# EAGLE schematic FPGA Shield Adapter (EAGLE 9.5.0)
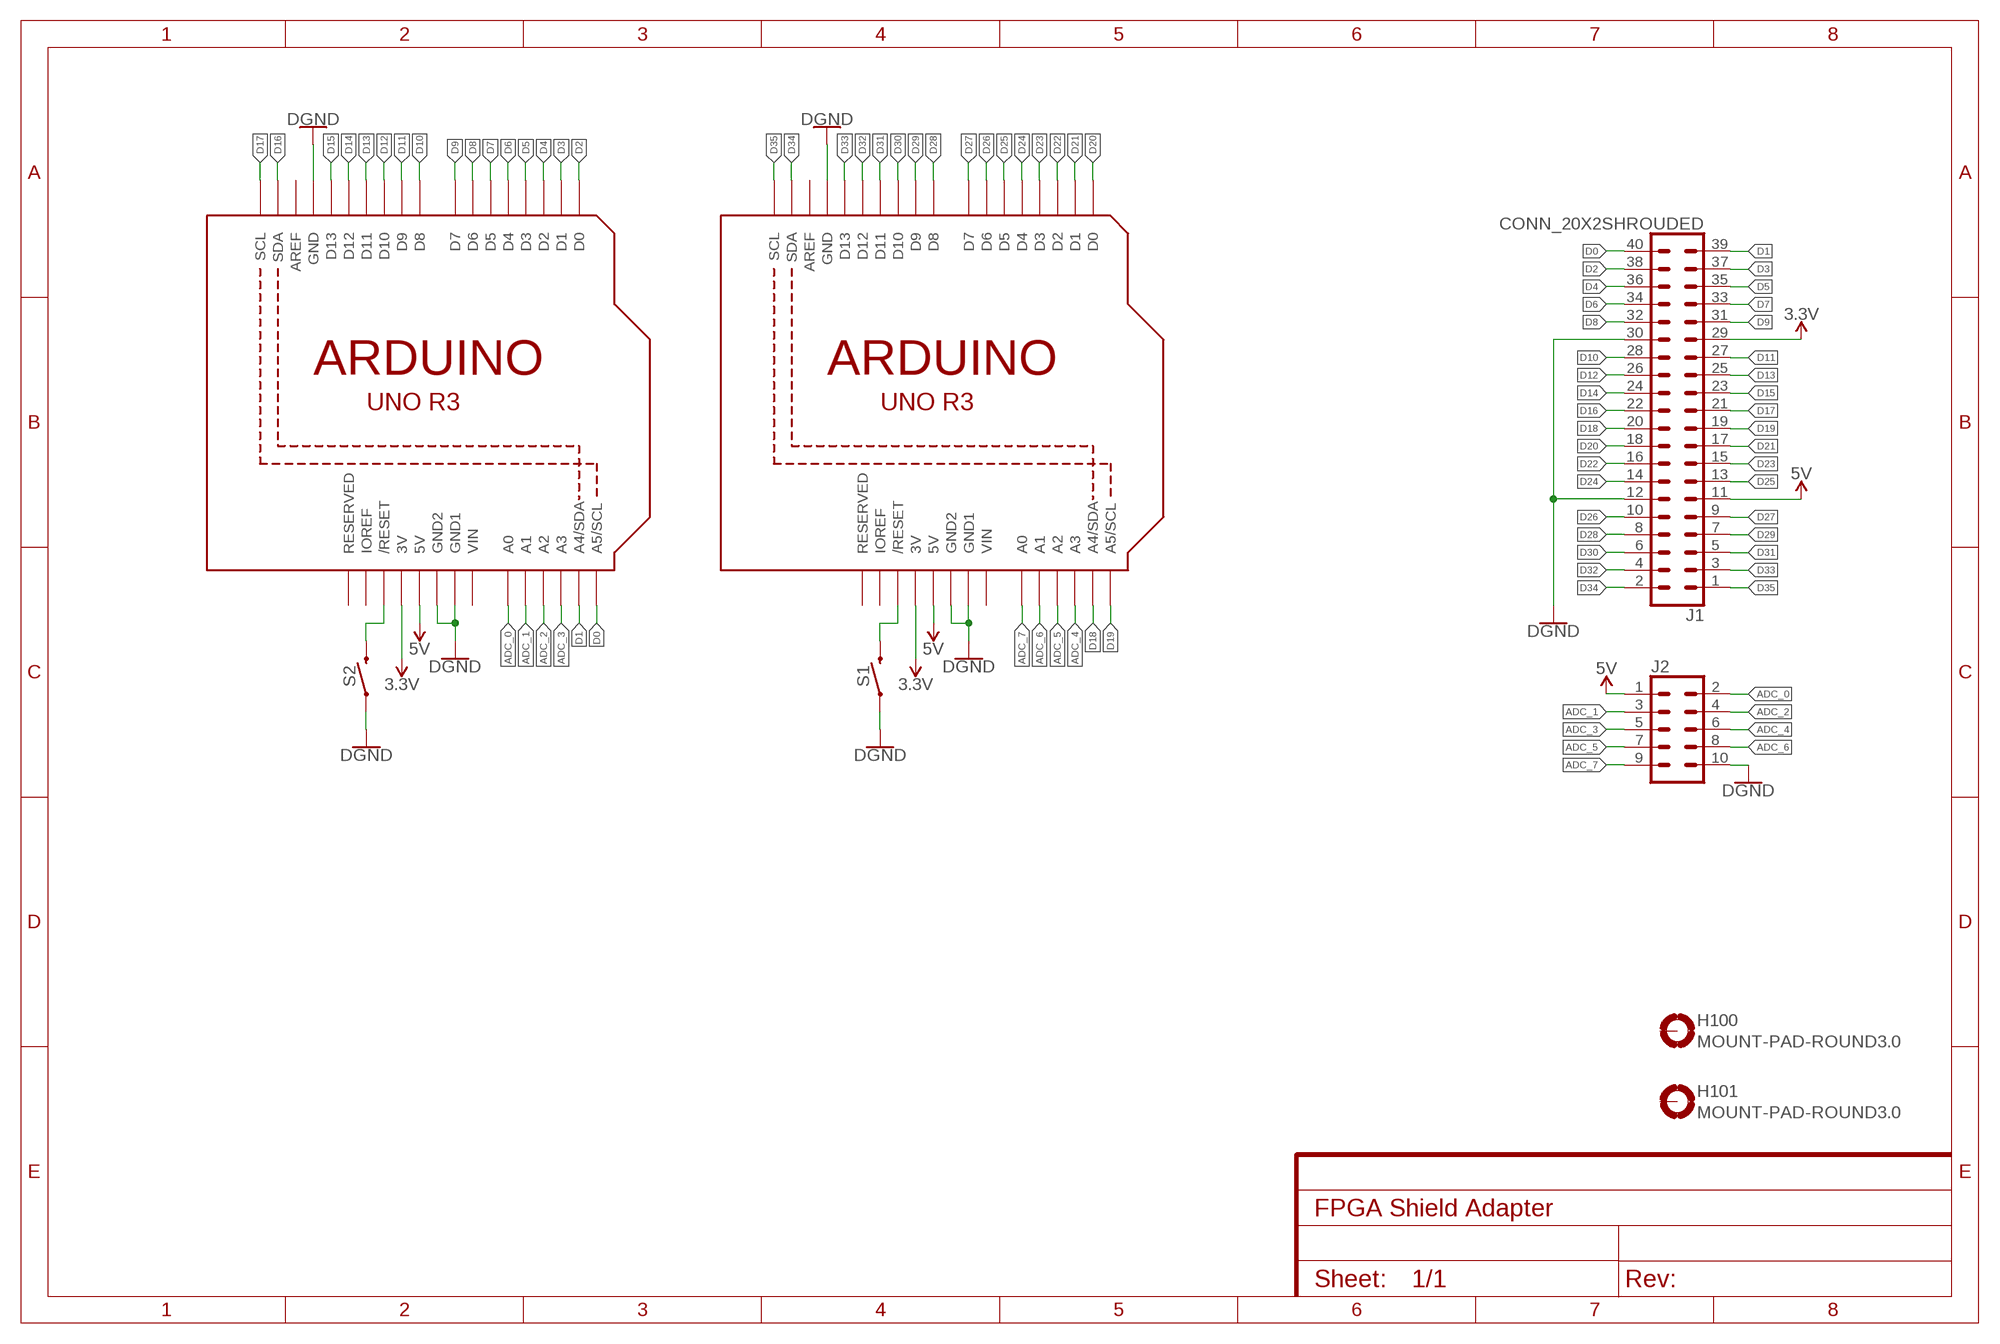
[diagram p0: schematic, sheet 1]

## Parts
H100  MOUNT-PAD-ROUND3.0  [3,0-PAD]
H101  MOUNT-PAD-ROUND3.0  [3,0-PAD]
J1  CONN_20X2SHROUDED  [2X20_SHROUDED]
J2  CONN_05X2SHD  [2X5-SHROUDED]
S1  MOMENTARY-SWITCH-SPST-SMD-5.2MM  [TACTILE_SWITCH_SMD_5.2MM]
S2  MOMENTARY-SWITCH-SPST-SMD-5.2MM  [TACTILE_SWITCH_SMD_5.2MM]
U1  ARDUINOR3NODIM  [ARDUINOR3-NODIM]
U2  ARDUINOR3NODIM  [ARDUINOR3-NODIM]

## Nets
3.3V: J1.29 U1.3V U2.3V
5V: J1.11 J2.1 U1.5V U2.5V
ADC_0: J2.2 U2.A0
ADC_1: J2.3 U2.A1
ADC_2: J2.4 U2.A2
ADC_3: J2.5 U2.A3
ADC_4: J2.6 U1.A3
ADC_5: J2.7 U1.A2
ADC_6: J2.8 U1.A1
ADC_7: J2.9 U1.A0
D0: J1.40 U2.A5(A5/SCL)
D1: J1.39 U2.A4(A4/SDA)
D2: J1.38 U2.D0
D3: J1.37 U2.D1
D4: J1.36 U2.D2
D5: J1.35 U2.D3
D6: J1.34 U2.D4
D7: J1.33 U2.D5
D8: J1.32 U2.D6
D9: J1.31 U2.D7
D10: J1.28 U2.D8
D11: J1.27 U2.D9
D12: J1.26 U2.D10
D13: J1.25 U2.D11
D14: J1.24 U2.D12
D15: J1.23 U2.D13
D16: J1.22 U2.SDA
D17: J1.21 U2.SCL
D18: J1.20 U1.A4(A4/SDA)
D19: J1.19 U1.A5(A5/SCL)
D20: J1.18 U1.D0
D21: J1.17 U1.D1
D22: J1.16 U1.D2
D23: J1.15 U1.D3
D24: J1.14 U1.D4
D25: J1.13 U1.D5
D26: J1.10 U1.D6
D27: J1.9 U1.D7
D28: J1.8 U1.D8
D29: J1.7 U1.D9
D30: J1.6 U1.D10
D31: J1.5 U1.D11
D32: J1.4 U1.D12
D33: J1.3 U1.D13
D34: J1.2 U1.SDA
D35: J1.1 U1.SCL
GND: J1.12 J1.30 J2.10 S1.1 S2.1 U1.GND U1.GND1 U1.GND2 U2.GND U2.GND1 U2.GND2 ; supply symbol labelled DGND
N$1: S2.3 U2.RESET(/RESET)
N$2: S1.3 U1.RESET(/RESET)
Unconnected: H100.B3,0(MOUNT) H101.B3,0(MOUNT) U1.AREF U1.IOREF U1.RESERVED U2.AREF U2.IOREF U2.RESERVED

## Power pins joined to a net without a drawn wire
VIN: U1.VIN U2.VIN

## Library data of the parts
H100 H101 = holes:MOUNT-PAD-ROUND: MOUNTING PAD, round
J1 = SparkFun-Connectors:CONN_20X2: Multi connection point. Often used as Generic Header-pin footprint for 0.1 inch spaced/style header connections On any of the 0.1 inch spaced packages, you can populate with these: Break Away Headers - Straight <https://www.sparkfun.com/products/116> (PRT-00116) Break Away Male Headers - Right Angle <https://www.sparkfun.com/products/553> (PRT-00553) Female Headers <https://www.sparkfun.com/products/115> (PRT-00115) Break Away Headers - Machine Pin <https://www.sparkfun.com/products/117> (PRT-00117) Break Away Female Headers - Swiss Machine Pin <https://www.sparkfun.com/products/743> (PRT-00743); PROD_ID: CONN-12263; SF_ID: CONN-12263
J2 = SparkFun-Connectors:CONN_05X2: Multi connection point. Often used as Generic Header-pin footprint for 0.1 inch spaced/style header connections For AVR SPI programming port, see special device with nice symbol: "AVR_SPI_PROG_5x2.dev" You can populate with any combo of single row headers, but if you'd like an exact match, check these: 2x5 AVR ICSP Male Header <https://www.sparkfun.com/products/778> (PRT-00778) 2x5 Pin Shrouded Header <https://www.sparkfun.com/products/8506> (PRT-08506) On any of the 0.1 inch spaced packages, you can populate with these: Break Away Headers - Straight <https://www.sparkfun.com/products/116> (PRT-00116) Break Away Male Headers - Right Angle <https://www.sparkfun.com/products/553> (PRT-00553) Female Headers <https://www.sparkfun.com/products/115> (PRT-00115) Break Away Headers - Machine Pin <https://www.sparkfun.com/products/117> (PRT-00117) Break Away Female Headers - Swiss Machine Pin <https://www.sparkfun.com/products/743> (PRT-00743) Special note: the shrouded connector mates well with our 5x2 ribbon cables: 2x5 Pin IDC Ribbon Cable <https://www.sparkfun.com/products/8535> (PRT-08535); PROD_ID: CONN-08671; SF_ID: PRT-08506
S1 S2 = SparkFun-Switches:MOMENTARY-SWITCH-SPST: Momentary Switch (Pushbutton) - SPST Normally-open (NO) SPST momentary switches (buttons, pushbuttons). Variants PTH-12MM - 12mm square, through-hole Momentary Pushbutton Switch - 12mm Square <https://www.sparkfun.com/products/9190> (COM-09190) PTH-6.0MM, PTH-6.0MM-KIT - 6.0mm square, through-hole Mini Pushbutton Switch <https://www.sparkfun.com/products/97> (COM-00097) KIT package intended for soldering kit's - only one side of pads' copper is exposed. PTH-RIGHT-ANGLE-KIT - Right-angle, through-hole Right Angle Tactile Button <https://www.sparkfun.com/products/10791> - Used on SparkFun BigTime Watch Kit <https://www.sparkfun.com/products/11734> SMD-12MM - 12mm square, surface-mount Tactile Button - SMD (12mm) <https://www.sparkfun.com/products/12993> (COM-12993) Used on SparkFun PicoBoard <https://www.sparkfun.com/products/11888> SMD-4.5MM - 4.5mm Square Trackball Switch Used on SparkFun Blackberry Trackballer Breakout <https://www.sparkfun.com/products/13169> SMD-4.6MMX2.8MM - 4.60mm x 2.80mm, surface mount Used on SparkFun SAMD21 Mini Breakout <https://www.sparkfun.com/products/13664> SMD-5.2MM, SMD-5.2-REDUNDANT - 5.2mm square, surface-mount Mini Pushbutton Switch - SMD <https://www.sparkfun.com/products/8720> (COM-08720) Used on Arduino Pro Mini <https://www.sparkfun.com/products/11114> REDUNDANT package connects both switch circuits together SMD-6.0X3.5MM - 6.0 x 3.5mm, surface mount Momentary Reset Switch SMD <https://www.sparkfun.com/products/8229> (COM-08229) SMD-6.2MM-TALL - 6.2mm square, surface mount Tactile Button - SMD (6mm) <https://www.sparkfun.com/products/12992> Used on SparkFun Digital Sandbox <https://www.sparkfun.com/products/12651> SMD-RIGHT-ANGLE - Right-angle, surface mount Used on SparkFun Block for Intel® Edison - Arduino <https://www.sparkfun.com/products/13036>; PROD_ID: SWCH-08247; SF_SKU: COM-08720
U1 U2 = microbuilder:ARDUINOR3: This is a new object for the new Arduino R3 - with extra pins that you may want to use (such as IOref, and duplicated A4/A5